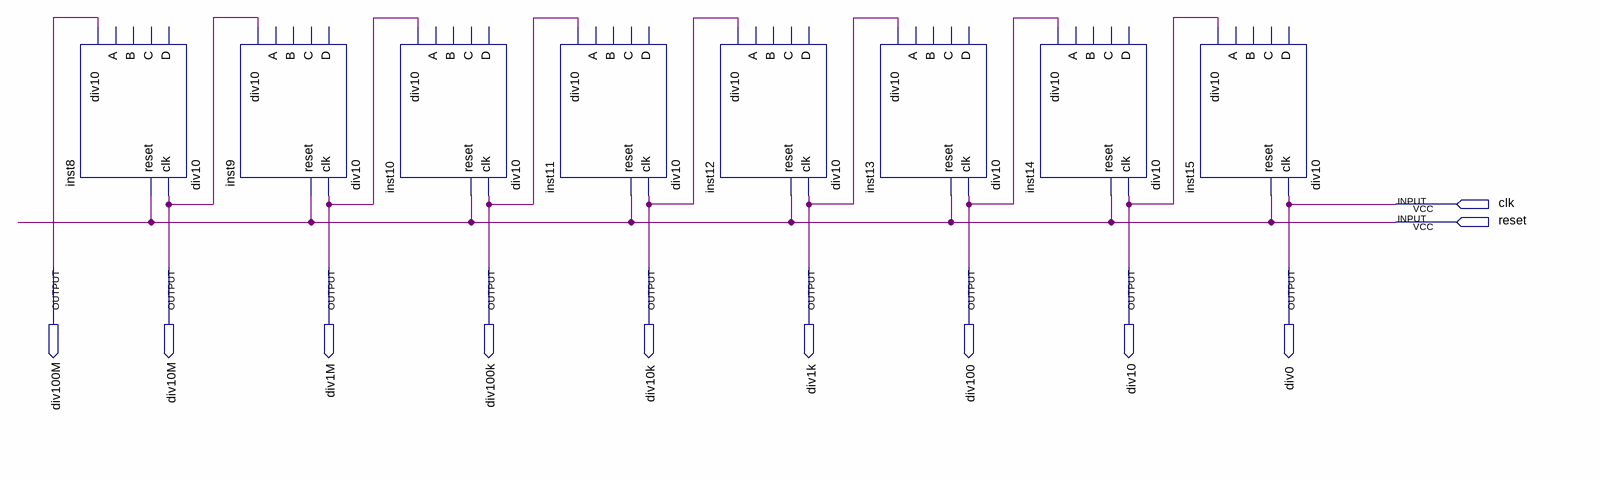
[diagram p0: schematic sheet]
// Quartus schematic div100M.bdf as structural Verilog: 8 symbols, 11 pins
module div100M (
  input  clk,
  input  reset,
  output div100M,
  output div10M,
  output div1M,
  output div100k,
  output div10k,
  output div1k,
  output div100,
  output div10,
  output div0
);

  div10 inst8 (.clk(div10M), .reset(reset), .div10(div100M));  // open: D, C, B, A
  div10 inst9 (.clk(div1M), .reset(reset), .div10(div10M));  // open: D, C, B, A
  div10 inst10 (.clk(div100k), .reset(reset), .div10(div1M));  // open: D, C, B, A
  div10 inst11 (.clk(div10k), .reset(reset), .div10(div100k));  // open: D, C, B, A
  div10 inst12 (.clk(div1k), .reset(reset), .div10(div10k));  // open: D, C, B, A
  div10 inst13 (.clk(div100), .reset(reset), .div10(div1k));  // open: D, C, B, A
  div10 inst14 (.clk(div10), .reset(reset), .div10(div100));  // open: D, C, B, A
  div10 inst15 (.clk(clk), .reset(reset), .div10(div10));  // open: D, C, B, A

  assign div0 = clk;
endmodule
